# EAGLE schematic Kheera-PanelPCB (EAGLE 9.6.0)
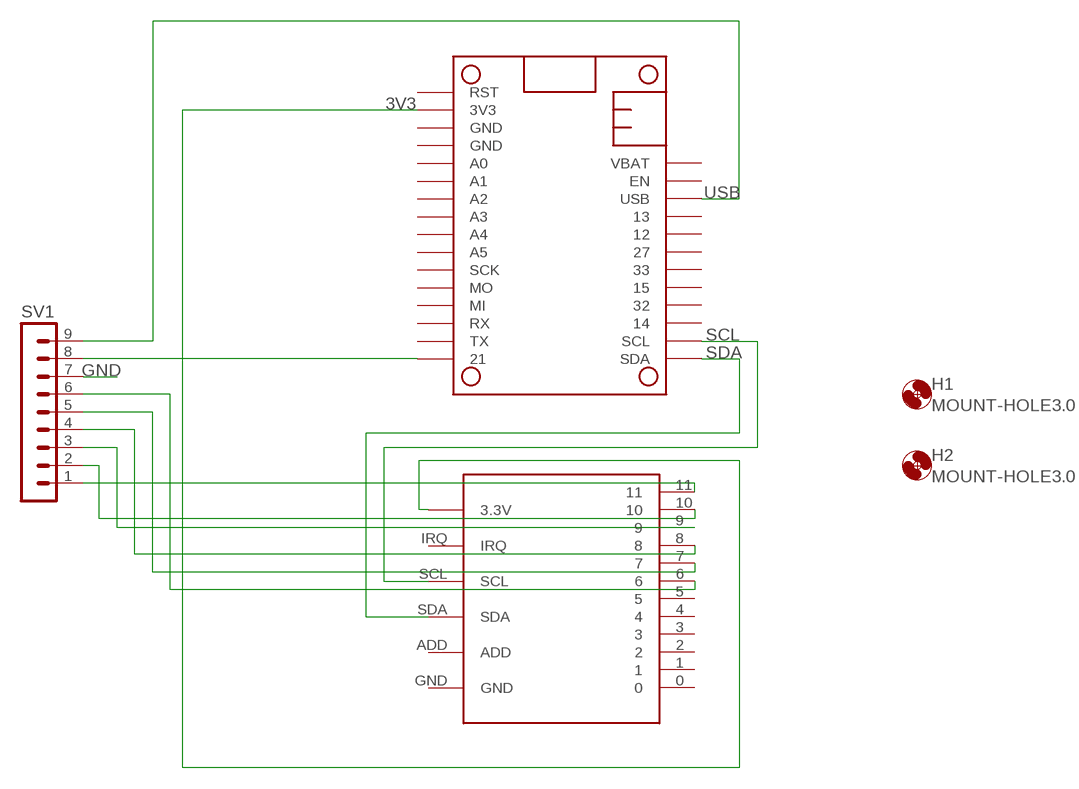
[diagram p0: schematic, sheet 1]

## Parts
H1  MOUNT-HOLE3.0  [3,0]
H2  MOUNT-HOLE3.0  [3,0]
M1  RARNDT-MISCELANEOUS_FEATHERBOARD_ESP32FETHERWING_DIM_ESP32  [RARNDT-MISCELANEOUS_FEATHERBOARD_ESP32]
SV1  MA09-1  [MA09-1]
U$5  MS-121  [MS-121]

## Nets
3V3: M1.2(3V3) U$5.3.3V
GND: SV1.7
N$1: M1.16 SV1.8
N$2: SV1.1 U$5.11
N$3: SV1.2 U$5.10
N$4: SV1.3 U$5.9
N$5: SV1.4 U$5.8
N$6: SV1.5 U$5.7
N$7: SV1.6 U$5.6
SCL: M1.18(SCL) U$5.SCL
SDA: M1.17(SDA) U$5.SDA
USB: M1.26(USB) SV1.9
Unconnected: M1.1(RST) M1.3(GND) M1.5(A0) M1.6(A1) M1.7(A2) M1.8(A3) M1.9(A4) M1.10(A5) M1.11(SCK) M1.12(MO) M1.13(MI) M1.14(RX) M1.15(TX) M1.19 M1.20 M1.21 M1.22 M1.23 M1.24 M1.25 M1.27(EN) M1.28(VBAT) U$5.0 U$5.1 U$5.2 U$5.3 U$5.4 U$5.5 U$5.ADD U$5.IRQ

## Power pins joined to a net without a drawn wire
GND: M1.4(GND) U$5.GND

## Library data of the parts
H1 H2 = holes:MOUNT-HOLE: MOUNTING HOLE with drill center marker
M1 = StewartPlatform:RARNDT-MISCELANEOUS_FEATHERBOARD_ESP32
SV1 = con-lstb:MA09-1: PIN HEADER; OC_FARNELL: unknown; OC_NEWARK: unknown
U$5 = MS-121:MS-121